# Altium project Unnecessarily Over Engineered Flight Controller.PrjPcb
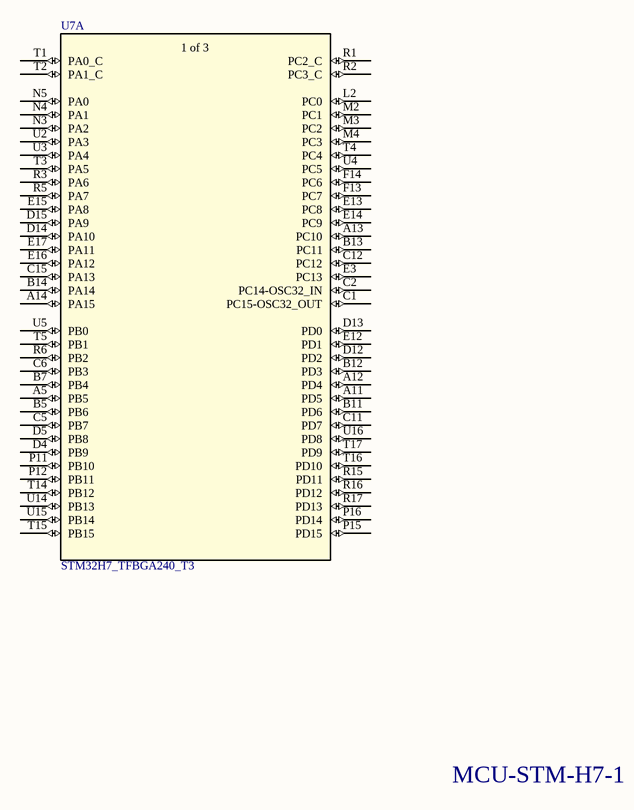
[diagram p0: STM32H7_PART_1.SchDoc]
5 sheets, 50 parts. Net scope: flat (ports and power ports of the same name join across sheets).
Sheets:
  STM32H7_PART_1.SchDoc
  STM32H7_PART_2.SchDoc
  STM32H7_PART_3.SchDoc
  STM32H7_PART_4.SchDoc
  STM32H7_POWER_MISCELLANEOUS.SchDoc

## Sheet STM32H7_PART_1.SchDoc
size A; Organization: Altium Limited; Address1: L3, 12a Rodborough Rd; Address2: Frenchs Forest; Address3: NSW; Address4: Australia 2086

### Parts
U7  STM32H7_TFBGA240_T3  [TFBGA240+25]  (part A of 4)

### Nets

Not connected (* = marked no-connect by the designer): U7 A5(PB5) A11(PD5) A12(PD4) A13(PC10) A14(PA15) B5(PB6) B7(PB4) B11(PD6) B12(PD3) B13(PC11) B14(PA14) C1(PC15-OSC32_OUT) C2(PC14-OSC32_IN) C5(PB7) C6(PB3) C11(PD7) C12(PC12) C15(PA13) D4(PB9) D5(PB8) D12(PD2) D13(PD0) D14(PA10) D15(PA9) E3(PC13) E12(PD1) E13(PC8) E14(PC9) E15(PA8) E16(PA12) E17(PA11) F13(PC7) F14(PC6) L2(PC0) M2(PC1) M3(PC2) M4(PC3) N3(PA2) N4(PA1) N5(PA0) P11(PB10) P12(PB11) P15(PD15) P16(PD14) R1(PC2_C) R2(PC3_C) R3(PA6) R5(PA7) R6(PB2) R15(PD11) R16(PD12) R17(PD13) T1(PA0_C) T2(PA1_C) T3(PA5) T4(PC4) T5(PB1) T14(PB12) T15(PB15) T16(PD10) T17(PD9) U2(PA3) U3(PA4) U4(PC5) U5(PB0) U14(PB13) U15(PB14) U16(PD8)

### Notes on the sheet
- MCU-STM-H7-1
- Title
- Size:
- Date:
- A
- Number:
- Time:
- Revision:
- Sheet
- of
- File:
- (in symbol STM32H7_TFBGA240, part A) 1 of 3

### Library data of the parts
U7 = STM32H7_TFBGA240: No Description Available; Vendor: STMicroelectronics; Copyright: Copyright (C) 2018 Accelerated Designs. All rights reserved; Manufacturer_Part_Number: STM32H7_TFBGA240_T3; RefDes: RefDes; Type: DEV

## Sheet STM32H7_PART_2.SchDoc
size A; Organization: Altium Limited; Address1: L3, 12a Rodborough Rd; Address2: Frenchs Forest; Address3: NSW; Address4: Australia 2086
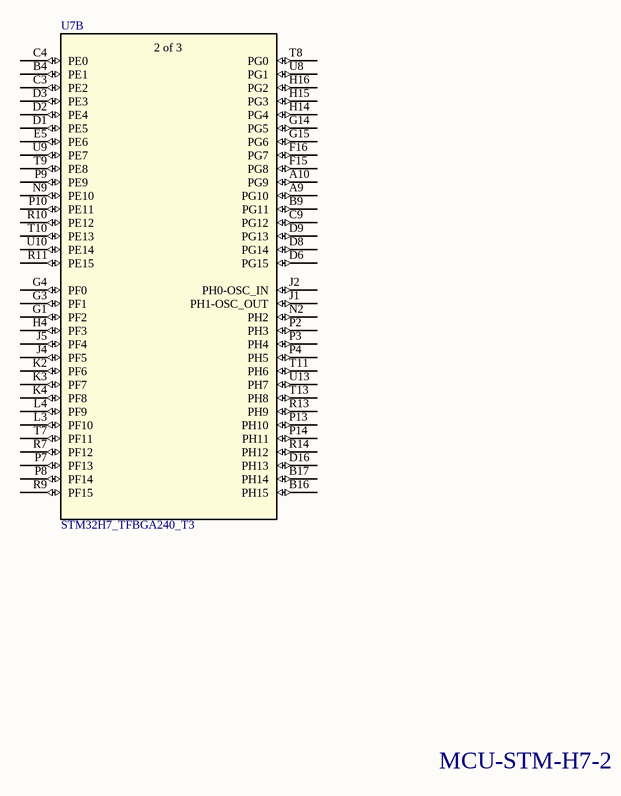
[diagram p1: STM32H7_PART_2.SchDoc]

### Parts
U7  STM32H7_TFBGA240_T3  [TFBGA240+25]  (part B of 4)

### Nets

Not connected (* = marked no-connect by the designer): U7 A9(PG10) A10(PG9) B4(PE1) B9(PG11) B16(PH15) B17(PH14) C3(PE2) C4(PE0) C9(PG12) D1(PE5) D2(PE4) D3(PE3) D6(PG15) D8(PG14) D9(PG13) D16(PH13) E5(PE6) F15(PG8) F16(PG7) G1(PF2) G3(PF1) G4(PF0) G14(PG5) G15(PG6) H4(PF3) H14(PG4) H15(PG3) H16(PG2) J1(PH1-OSC_OUT) J2(PH0-OSC_IN) J4(PF5) J5(PF4) K2(PF6) K3(PF7) K4(PF8) L3(PF10) L4(PF9) N2(PH2) N9(PE10) P2(PH3) P3(PH4) P4(PH5) P7(PF13) P8(PF14) P9(PE9) P10(PE11) P13(PH10) P14(PH11) R7(PF12) R9(PF15) R10(PE12) R11(PE15) R13(PH9) R14(PH12) T7(PF11) T8(PG0) T9(PE8) T10(PE13) T11(PH6) T13(PH8) U8(PG1) U9(PE7) U10(PE14) U13(PH7)

### Notes on the sheet
- MCU-STM-H7-2
- Title
- Size:
- Date:
- A
- Number:
- Time:
- Revision:
- Sheet
- of
- File:
- (in symbol STM32H7_TFBGA240, part B) 2 of 3

### Library data of the parts
U7 = STM32H7_TFBGA240: as U7 on sheet STM32H7_PART_1; Copyright: Copyright (C) 2018 Accelerated Designs. All rights reserved; Manufacturer_Part_Number: STM32H7_TFBGA240_T3; RefDes: RefDes; Type: DEV

## Sheet STM32H7_PART_3.SchDoc
size A; Organization: Altium Limited; Address1: L3, 12a Rodborough Rd; Address2: Frenchs Forest; Address3: NSW; Address4: Australia 2086
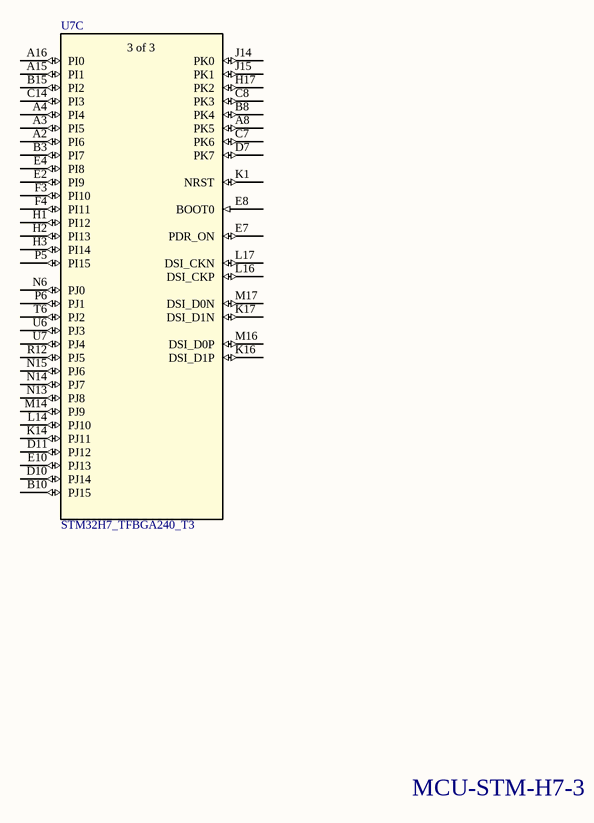
[diagram p2: STM32H7_PART_3.SchDoc]

### Parts
U7  STM32H7_TFBGA240_T3  [TFBGA240+25]  (part C of 4)

### Nets

Not connected (* = marked no-connect by the designer): U7 A2(PI6) A3(PI5) A4(PI4) A8(PK5) A15(PI1) A16(PI0) B3(PI7) B8(PK4) B10(PJ15) B15(PI2) C7(PK6) C8(PK3) C14(PI3) D7(PK7) D10(PJ14) D11(PJ12) E2(PI9) E4(PI8) E7(PDR_ON) E8(BOOT0) E10(PJ13) F3(PI10) F4(PI11) H1(PI12) H2(PI13) H3(PI14) H17(PK2) J14(PK0) J15(PK1) K1(NRST) K14(PJ11) K16(DSI_D1P) K17(DSI_D1N) L14(PJ10) L16(DSI_CKP) L17(DSI_CKN) M14(PJ9) M16(DSI_D0P) M17(DSI_D0N) N6(PJ0) N13(PJ8) N14(PJ7) N15(PJ6) P5(PI15) P6(PJ1) R12(PJ5) T6(PJ2) U6(PJ3) U7(PJ4)

### Notes on the sheet
- MCU-STM-H7-3
- Title
- Size:
- Date:
- A
- Number:
- Time:
- Revision:
- Sheet
- of
- File:
- (in symbol STM32H7_TFBGA240, part C) 3 of 3

### Library data of the parts
U7 = STM32H7_TFBGA240: as U7 on sheet STM32H7_PART_1; Copyright: Copyright (C) 2018 Accelerated Designs. All rights reserved; Manufacturer_Part_Number: STM32H7_TFBGA240_T3; RefDes: RefDes; Type: DEV

## Sheet STM32H7_PART_4.SchDoc
size A; Organization: Altium Limited; Address1: L3, 12a Rodborough Rd; Address2: Frenchs Forest; Address3: NSW; Address4: Australia 2086
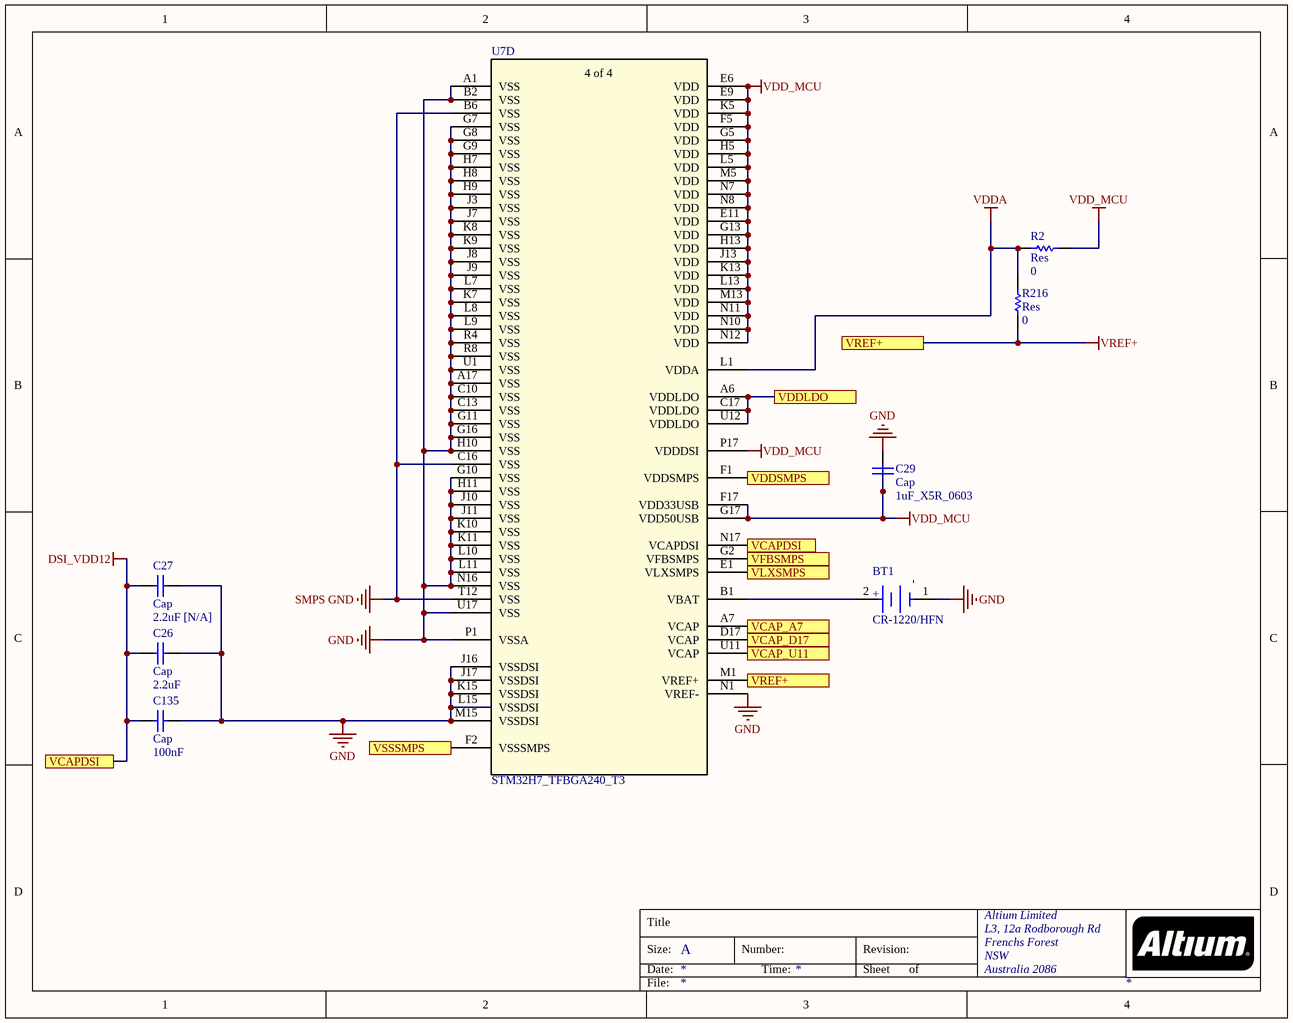
[diagram p3: STM32H7_PART_4.SchDoc]

### Parts
BT1  CR-1220/HFN  [FP-CR-1220-HFN-MFG]
C26  Cap  value 2.2uF  [RAD-0.3]
C27  Cap  value 2.2uF [N/A]  [RAD-0.3]
C29  Cap  value 1uF_X5R_0603  [RAD-0.3]
C135  Cap  value 100nF  [RAD-0.3]
R2  Res  value 0  [AXIAL-0.3]
R216  Res  value 0  [AXIAL-0.3]
U7  STM32H7_TFBGA240_T3  [TFBGA240+25]  (part D of 4)

### Ports
VCAP_A7, VCAP_D17, VCAP_U11, VCAPDSI, VDDLDO, VDDSMPS, VFBSMPS, VLXSMPS, VREF+, VSSSMPS

### Nets
DSI_VDD12: C26.1 C27.1 C135.1 U7.A6(VDDLDO) U7.B6(VSS) U7.C16(VSS) U7.C17(VDDLDO) U7.F2(VSSSMPS) U7.N17(VCAPDSI) U7.T12(VSS) U7.U12(VDDLDO) ; port VCAPDSI, port VSSSMPS, port VDDLDO  [also labelled SMPS GND]
GND: BT1.1(C) C26.2 C27.2 C29.2 C135.2 U7.A1(VSS) U7.A17(VSS) U7.B2(VSS) U7.C10(VSS) U7.C13(VSS) U7.G7(VSS) U7.G8(VSS) U7.G9(VSS) U7.G10(VSS) U7.G11(VSS) U7.G16(VSS) U7.H7(VSS) U7.H8(VSS) U7.H9(VSS) U7.H10(VSS) U7.H11(VSS) U7.J3(VSS) U7.J7(VSS) U7.J8(VSS) U7.J9(VSS) U7.J10(VSS) U7.J11(VSS) U7.J16(VSSDSI) U7.J17(VSSDSI) U7.K7(VSS) U7.K8(VSS) U7.K9(VSS) U7.K10(VSS) U7.K11(VSS) U7.K15(VSSDSI) U7.L7(VSS) U7.L8(VSS) U7.L9(VSS) U7.L10(VSS) U7.L11(VSS) U7.L15(VSSDSI) U7.M15(VSSDSI) U7.N1(VREF-) U7.N16(VSS) U7.P1(VSSA) U7.R4(VSS) U7.R8(VSS) U7.U1(VSS) U7.U17(VSS)
VDD SDC: U7.A7(VCAP) U7.D17(VCAP) U7.G2(VFBSMPS) U7.U11(VCAP) ; port VFBSMPS, port VCAP_A7, port VCAP_D17, port VCAP_U11
VDD_MCU: C29.1 R2.2 U7.E6(VDD) U7.E9(VDD) U7.E11(VDD) U7.F5(VDD) U7.F17(VDD33USB) U7.G5(VDD) U7.G13(VDD) U7.G17(VDD50USB) U7.H5(VDD) U7.H13(VDD) U7.J13(VDD) U7.K5(VDD) U7.K13(VDD) U7.L5(VDD) U7.L13(VDD) U7.M5(VDD) U7.M13(VDD) U7.N7(VDD) U7.N8(VDD) U7.N10(VDD) U7.N11(VDD) U7.N12(VDD) U7.P17(VDDDSI)
VDDA: R2.1 R216.2 U7.L1(VDDA)
VREF+: R216.1 U7.M1(VREF+) ; port VREF+
NetBT1_2: BT1.2(A) U7.B1(VBAT)
NetC12_2: U7.F1(VDDSMPS) ; port VDDSMPS
NetC188_2: U7.E1(VLXSMPS) ; port VLXSMPS

### Notes on the sheet
- Title
- Size:
- Date:
- A
- Number:
- Time:
- Revision:
- Sheet
- of
- File:
- (in symbol CMP-05417-000010-1) -; +
- (in symbol STM32H7_TFBGA240, part D) 4 of 4

### Library data of the parts
BT1 = CMP-05417-000010-1: BATTERY LITHIUM 3V COIN 12.5MM; Manufacturer: Panasonic; Standoff Height: 2.9mm; Temperature Range High: +60°C; Temperature: -30°C to +60°C; Device Class L2: unset; Height: 5.5mm; Category: Batt; Device Class L3: unset; Package: CR-1220/HFN; ComponentLink2URL: https://industrial.panasonic.com/cdbs/www-data/pdf2/AAA4000/AAA4000D138.PDF; ComponentLink2Description: Datasheet; Temperature Range Low: -30°C; Mouser Description: CR1220 Series Ø 12.5 mm 3 V 35 mAh Non-Rechargeable Lithium Coin Cell Battery; Octopart: https://octopart.com/cr-1220%2Fhfn-panasonic-13183313; Manufacturer Part Number: CR-1220/HFN; Automotive: No; Digikey Description: BATTERY LITHIUM 3V COIN 12.5MM; Device Class L1: Passive Components
C26 C27 C29 C135 = Cap: Capacitor; Published: 8-Jun-2000; LatestRevisionDate: 17-Jul-2002; LatestRevisionNote: Re-released for DXP Platform.; PackageReference: RAD-0.3; Publisher: Altium Limited; PackageDescription: Radial Cap, Thru-Hole; 2 Leads; 0.3 in Pin Spacing
R2 R216 = Res1: Resistor; Published: 8-Jun-2000; LatestRevisionDate: 17-Jul-2002; LatestRevisionNote: Re-released for DXP Platform.; PackageReference: AXIAL-0.3; Publisher: Altium Limited; PackageDescription: Axial Device, Thru-Hole; 2 Leads; 0.3 in Pin Spacing
U7 = STM32H7_TFBGA240: as U7 on sheet STM32H7_PART_1; Copyright: Copyright (C) 2018 Accelerated Designs. All rights reserved; Manufacturer_Part_Number: STM32H7_TFBGA240_T3; RefDes: RefDes; Type: DEV

## Sheet STM32H7_POWER_MISCELLANEOUS.SchDoc
size A; Organization: Altium Limited; Address1: L3, 12a Rodborough Rd; Address2: Frenchs Forest; Address3: NSW; Address4: Australia 2086
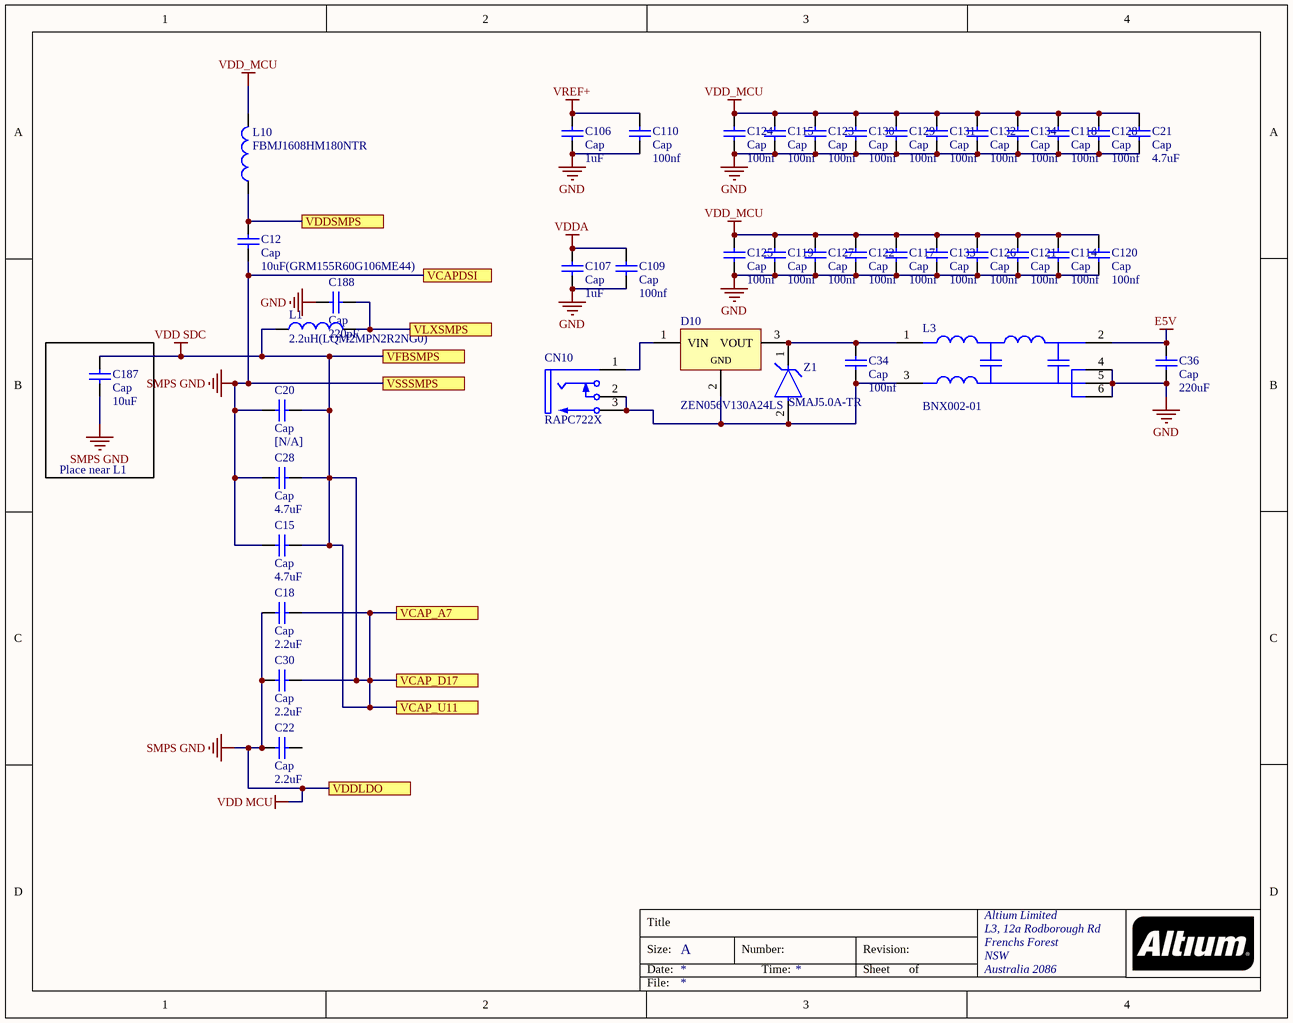
[diagram p4: STM32H7_POWER_MISCELLANEOUS.SchDoc]

### Parts
C12  Cap  value 10uF(GRM155R60G106ME44)  [RAD-0.3]
C15  Cap  value 4.7uF  [RAD-0.3]
C18  Cap  value 2.2uF  [RAD-0.3]
C20  Cap  value [N/A]  [RAD-0.3]
C21  Cap  value 4.7uF  [RAD-0.3]
C22  Cap  value 2.2uF  [RAD-0.3]
C28  Cap  value 4.7uF  [RAD-0.3]
C30  Cap  value 2.2uF  [RAD-0.3]
C34  Cap  value 100nf  [RAD-0.3]
C36  Cap  value 220uF  [RAD-0.3]
C106  Cap  value 1uF  [RAD-0.3]
C107  Cap  value 1uF  [RAD-0.3]
C109  Cap  value 100nf  [RAD-0.3]
C110  Cap  value 100nf  [RAD-0.3]
C114  Cap  value 100nf  [RAD-0.3]
C115  Cap  value 100nf  [RAD-0.3]
C117  Cap  value 100nf  [RAD-0.3]
C118  Cap  value 100nf  [RAD-0.3]
C119  Cap  value 100nf  [RAD-0.3]
C120  Cap  value 100nf  [RAD-0.3]
C121  Cap  value 100nf  [RAD-0.3]
C122  Cap  value 100nf  [RAD-0.3]
C123  Cap  value 100nf  [RAD-0.3]
C124  Cap  value 100nf  [RAD-0.3]
C125  Cap  value 100nf  [RAD-0.3]
C126  Cap  value 100nf  [RAD-0.3]
C127  Cap  value 100nf  [RAD-0.3]
C128  Cap  value 100nf  [RAD-0.3]
C129  Cap  value 100nf  [RAD-0.3]
C130  Cap  value 100nf  [RAD-0.3]
C131  Cap  value 100nf  [RAD-0.3]
C132  Cap  value 100nf  [RAD-0.3]
C133  Cap  value 100nf  [RAD-0.3]
C134  Cap  value 100nf  [RAD-0.3]
C187  Cap  value 10uF  [RAD-0.3]
C188  Cap  value 220pF  [RAD-0.3]
CN10  RAPC722X  [SWITCH-RAPC712X-3_V]
D10  ZEN056V130A24LS  [TECO-ZEN056V130A24LS_V]
L1  2.2uH(LQM2MPN2R2NG0)  [0402-A]
L3  BNX002-01  [MURA-BNX002-6]
L10  FBMJ1608HM180NTR  [0402-A]
Z1  SMAJ5.0A-TR  [FP-SMA-MFG]

### Blocks framed on the sheet
Place near L1: C187

### Ports
VCAP_A7, VCAP_D17, VCAP_U11, VCAPDSI, VDDLDO, VDDSMPS, VFBSMPS, VLXSMPS, VSSSMPS

### Nets
E5V: C36.2 L3.2(CB)
GND: C21.1 C36.1 C106.1 C107.1 C109.1 C110.1 C114.1 C115.1 C117.1 C118.1 C119.1 C120.1 C121.1 C122.1 C123.1 C124.1 C125.1 C126.1 C127.1 C128.1 C129.1 C130.1 C131.1 C132.1 C133.1 C134.1 C188.1 L3.4(CG) L3.5(CG) L3.6(CG)
SMPS GND: C12.1 C15.1 C18.1 C20.1 C22.1 C28.1 C30.1 C187.1 ; port VCAPDSI, port VDDLDO, port VSSSMPS  [also labelled VDD MCU]  [project net DSI_VDD12]
VDD SDC: C15.2 C18.2 C20.2 C28.2 C30.2 C187.2 L1.1 ; port VFBSMPS, port VCAP_A7, port VCAP_D17, port VCAP_U11
VDD_MCU: C21.2 C114.2 C115.2 C117.2 C118.2 C119.2 C120.2 C121.2 C122.2 C123.2 C124.2 C125.2 C126.2 C127.2 C128.2 C129.2 C130.2 C131.2 C132.2 C133.2 C134.2 L10.2
VDDA: C107.2 C109.2
VREF+: C106.2 C110.2
NetC12_2: C12.2 L10.1 ; port VDDSMPS
NetC34_1: C34.1 CN10.2 CN10.3 D10.2(GND) L3.3(PSG) Z1.2(A)
NetC34_2: C34.2 D10.3(VOUT) L3.1(B) Z1.1(K)
NetC188_2: C188.2 L1.2 ; port VLXSMPS
NetCN10_1: CN10.1 D10.1(VIN)

Not connected (* = marked no-connect by the designer): C22 2

### Notes on the sheet
- Title
- Size:
- Date:
- A
- Number:
- Time:
- Revision:
- Sheet
- of
- File:

### Library data of the parts
C12 C15 C18 C20-C22 C28 C30 C34 C36 C106 C107 C109 C110 C114 C115 C117-C134 C187 C188 = Cap: Capacitor; Published: 8-Jun-2000; LatestRevisionDate: 17-Jul-2002; LatestRevisionNote: Re-released for DXP Platform.; PackageReference: RAD-0.3; Publisher: Altium Limited; PackageDescription: Radial Cap, Thru-Hole; 2 Leads; 0.3 in Pin Spacing
CN10 = CMP-2000-05384-1: Power Jack, 5 A, 3-Pin THD, RoHS, Bulk; Manufacturer: Switchcraft; Current Rating: 5A; Plug/Mating Plug Diameter: 2.1mmID,5.5mmOD; Gender: Male; Mating Products: S765-ND / -CONNPLUGMINIPWR2CONDWHT/RED / S760K-ND / -CONNPOWERPLUGMINI.08"BLACK / SC1052-ND / -CONNPOWERPLUGMINIBLACK; Number of Positions/Contacts: 2Conductors,2Contacts; Internal Switch(s): SingleSwitch,NormallyClosed; Shielding: Unshielded; Catalog Drawings: RAPC7(1,2)2XSide / RAPC7(1,2)2XTop; Dynamic Catalog: SwitchcraftInc; Other Names: Q2287470A / RAPC722X-ND / SC1313; Standard Package: 2,500; Termination: SolderEyelet(s); Family: Barrel-PowerConnectors; Housing Color: Black; Housing Material: Thermoplastic; RoHS Information: SwitchcraftRoHSInfo; Color: Black; Contact Material - Plating: Nickel; Mounting Type: ThroughHole,RightAngle; Manufacturer URL: http://www.switchcraft.com/; Contact Material: Brass; Datasheet Version: Rev. A, 08/2005; Connector Type: Jack; Category: Connectors,Interconnects; Datasheet URL: http://www.mouser.com/ds/2/393/rapc722x_cd-371352.pdf
D10 = CMP-2000-07426-1: Polymer Enhanced Zener Diode Micro-Assembly, 5.45 to 5.75 V, -40 to 85 degC, 3-Pin SMD, RoHS, Tape and Reel; Manufacturer: TE Connectivity; Zener Test Current: 100mA; Zener Voltage (Typ): 5.6V; Product Depth (mm): 4.15(Max)mm; Product Height (mm): 2mm; Knee Impedance: 0.16Ohm; Capacitance Value: 4200pF(Typ); ESD Protection Voltage: 15KV@HBM; Power Dissipation: 30000mW; Configuration: Single; Voltage Tolerance: 3%; Rad Hardened: No; Operating Temperature Max Deg. C: 85C; Package Reference: ZEN056V130A24LS; Datasheet Version: Rev. F, 05/2011; Packaging: TapeandReel; Mounting Style: SurfaceMount; Mounting: SurfaceMount; Operating Temp Range: -40Cto85C; Product Length (mm): 4.15(Max)mm; Pin Count: 3; Operating Temperature Min Deg. C: -40C; Operating Temperature Classification: Industrial; Suppressor Type: Polymer; Zener Voltage: 5.6V; Manufacturer URL: http://www.te.com/; Package Description: 3-Pin Surface Mount Device, Body 4 x 4 mm; Mounting Technology: SurfaceMount; Datasheet URL: https://datasheet.ciiva.com/361/eng-ss-scd26730-f-361409.pdf
L1 L10 = Inductor: Code_IEC: 1005; Published: 8-Jun-2000; LatestRevisionDate: 29-May-2009; LatestRevisionNote: IPC-7351 Footprint Added.; PackageReference: 0402-A; Publisher: Altium Limited; PackageDescription: Chip Inductor; Code_JEITA: 0402
L3 = CMP-2000-05262-1: MURATA BNX002-01 FILTER, POWER, EMI, 10A; Product Length (mm): 12mm; Voltage Rating Max: 50VDC; Product Depth (mm): 11mm; Product Height (mm): 13mm; Datasheet URL: http://www.murata.com/en-us/products/productdata/8796779053086/ENFH0004.pdf?1441769419000; Termination: PCPins; Mounting Style: ThroughHole; Manufacturer: Murata; Manufacturer URL: http://www.murata.com/; Current Rating (Max): 10A; Package Reference: BNX002; Package Description: 6-Pin Through Hole Device, Body 11 x 12 mm; Datasheet Version: Jul-14
Z1 = CMP-12225-000048-1: TVS DIODE 5V 13.4V SMA; Manufacturer: STMicroelectronics; Standoff Height: 0.05mm; Max Junction Temp: +150°C; Clamping Voltage: 9.2V; Number Of Channels: 1; Description: 13.4V Clamp 174A (8/20µs) Ipp Tvs Diode Surface Mount SMA (DO-214AC); Peak Pulse Power: 400W; Peak Pulse Current: 43.5A; Breakdown Voltage: 6.4V; Direction: Unidirectional; ComponentLink2Description: Datasheet; Lead Free: Yes; Package: SMA; Height: 2.65mm; Mouser Description: Transient Voltage Suppressor, TVS, Transil SMAJ Series, Unidirectional, 5 V, DO-214AC, 2, 6.4 V; Manufacturer Part Number: SMAJ5.0A-TR; Reverse Standoff Voltage: 5V; Temperature Range Low: -55°C; Device Class L1: Circuit Protection; RoHS: TRUE; Category: Diode; Automotive: No; ComponentLink2URL: https://www.st.com/resource/en/datasheet/smaj.pdf; Device Class L3: unset; Device Class L2: TVS Diodes; Temperature Range High: +150°C; Octopart: https://octopart.com/smaj5.0a-tr-stmicroelectronics-347063; Digikey Description: TVS DIODE 5V 13.4V SMA; Temperature: -55°C to +150°C

## Nets that join several sheets
DSI_VDD12: STM32H7_PART_4 (11 pins), STM32H7_POWER_MISCELLANEOUS (8 pins)
GND: STM32H7_PART_4 (49 pins), STM32H7_POWER_MISCELLANEOUS (30 pins)
VDD SDC: STM32H7_PART_4 (U7.A7 U7.D17 U7.G2 U7.U11), STM32H7_POWER_MISCELLANEOUS (7 pins)
VDD_MCU: STM32H7_PART_4 (25 pins), STM32H7_POWER_MISCELLANEOUS (22 pins)
VDDA: STM32H7_PART_4 (R2.1 R216.2 U7.L1), STM32H7_POWER_MISCELLANEOUS (C107.2 C109.2)
VREF+: STM32H7_PART_4 (R216.1 U7.M1), STM32H7_POWER_MISCELLANEOUS (C106.2 C110.2)
NetC12_2: STM32H7_PART_4 (U7.F1), STM32H7_POWER_MISCELLANEOUS (C12.2 L10.1)
NetC188_2: STM32H7_PART_4 (U7.E1), STM32H7_POWER_MISCELLANEOUS (C188.2 L1.2)